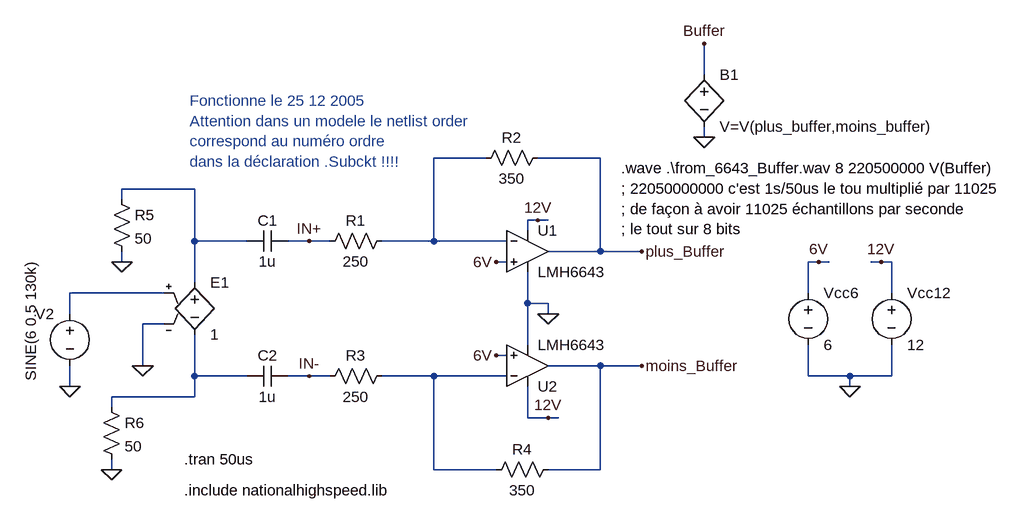
[diagram p0: schematic ADSL_buffer_LMH6643.asc]
ADSL_buffer_LMH6643.asc, the LTspice schematic file:
Version 4
SHEET 1 1004 680
WIRE -496 224 -496 192
WIRE -496 336 -496 304
WIRE -432 368 -432 352
WIRE -432 464 -432 448
WIRE -416 48 -416 32
WIRE -416 144 -416 128
WIRE -384 304 -384 240
WIRE -352 192 -496 192
WIRE -352 240 -384 240
WIRE -304 32 -416 32
WIRE -304 112 -304 32
WIRE -304 176 -304 112
WIRE -304 320 -304 256
WIRE -304 352 -432 352
WIRE -304 352 -304 320
WIRE -224 112 -304 112
WIRE -224 320 -304 320
WIRE -128 112 -160 112
WIRE -128 320 -160 320
WIRE -96 112 -128 112
WIRE -96 320 -128 320
WIRE 64 112 -16 112
WIRE 64 112 64 -16
WIRE 64 320 -16 320
WIRE 64 464 64 320
WIRE 144 -16 64 -16
WIRE 160 464 64 464
WIRE 176 112 64 112
WIRE 176 144 160 144
WIRE 176 288 160 288
WIRE 176 320 64 320
WIRE 208 96 208 80
WIRE 208 208 208 160
WIRE 208 272 208 208
WIRE 208 384 208 336
WIRE 224 80 208 80
WIRE 240 80 224 80
WIRE 240 208 208 208
WIRE 240 224 240 208
WIRE 240 384 208 384
WIRE 256 384 240 384
WIRE 320 -16 224 -16
WIRE 320 128 240 128
WIRE 320 128 320 -16
WIRE 320 304 240 304
WIRE 320 464 240 464
WIRE 320 464 320 304
WIRE 384 128 320 128
WIRE 384 304 320 304
WIRE 480 -144 480 -192
WIRE 480 -48 480 -64
WIRE 640 192 640 144
WIRE 640 320 640 272
WIRE 656 144 640 144
WIRE 672 144 656 144
WIRE 704 320 640 320
WIRE 704 336 704 320
WIRE 752 144 736 144
WIRE 768 144 752 144
WIRE 768 192 768 144
WIRE 768 320 704 320
WIRE 768 320 768 272
FLAG 704 336 0
FLAG 752 144 12V
FLAG 656 144 6V
FLAG 240 224 0
FLAG 160 144 6V
FLAG 160 288 6V
FLAG 384 128 plus_Buffer
FLAG 384 304 moins_Buffer
FLAG 224 80 12V
FLAG 240 384 12V
FLAG -128 112 IN+
FLAG -128 320 IN-
FLAG -384 304 0
FLAG -496 336 0
FLAG -432 464 0
FLAG -416 144 0
FLAG 480 -48 0
FLAG 480 -192 Buffer
SYMBOL voltage 768 176 R0
WINDOW 123 0 0 Left 0
WINDOW 39 0 0 Left 0
SYMATTR InstName Vcc12
SYMATTR Value 12
SYMBOL voltage 640 176 R0
WINDOW 123 0 0 Left 0
WINDOW 39 0 0 Left 0
SYMATTR InstName Vcc6
SYMATTR Value 6
SYMBOL res 240 -32 R90
WINDOW 0 0 56 VBottom 0
WINDOW 3 32 56 VTop 0
SYMATTR InstName R2
SYMATTR Value 350
SYMBOL res 0 96 R90
WINDOW 0 0 56 VBottom 0
WINDOW 3 32 56 VTop 0
SYMATTR InstName R1
SYMATTR Value 250
SYMBOL res 0 304 R90
WINDOW 0 0 56 VBottom 0
WINDOW 3 32 56 VTop 0
SYMATTR InstName R3
SYMATTR Value 250
SYMBOL res 256 448 R90
WINDOW 0 0 56 VBottom 0
WINDOW 3 32 56 VTop 0
SYMATTR InstName R4
SYMATTR Value 350
SYMBOL voltage -496 208 M0
WINDOW 123 24 132 Left 0
WINDOW 39 0 0 Left 0
WINDOW 3 60 -65 VRight 0
SYMATTR Value SINE(6 0.5 130k)
SYMATTR InstName V2
SYMBOL cap -160 96 R90
WINDOW 0 0 32 VBottom 0
WINDOW 3 32 32 VTop 0
SYMATTR InstName C1
SYMATTR Value 1u
SYMBOL cap -160 304 R90
WINDOW 0 0 32 VBottom 0
WINDOW 3 32 32 VTop 0
SYMATTR InstName C2
SYMATTR Value 1u
SYMBOL e -304 160 R0
SYMATTR InstName E1
SYMATTR Value 1
SYMBOL res -432 32 R0
SYMATTR InstName R5
SYMATTR Value 50
SYMBOL res -448 352 R0
SYMATTR InstName R6
SYMATTR Value 50
SYMBOL LMH6643 208 128 R0
SYMATTR InstName U1
SYMBOL LMH6643 208 304 M180
SYMATTR InstName U2
SYMBOL bv 480 -160 R0
SYMATTR InstName B1
SYMATTR Value V=V(plus_buffer,moins_buffer)
TEXT -320 448 Left 0 !.tran 50us
TEXT -320 496 Left 0 !.include nationalhighspeed.lib
TEXT -312 -104 Left 0 ;Fonctionne le 25 12 2005\nAttention dans un modele le netlist order \ncorrespond au numéro ordre \ndans la déclaration .Subckt !!!!
TEXT 352 0 Left 0 !.wave .\\from_6643_Buffer.wav 8 220500000 V(Buffer) \n; 22050000000 c'est 1s/50us le tou multiplié par 11025\n; de façon à avoir 11025 échantillons par seconde\n; le tout sur 8 bits

The netlist it stands for:
* ADSL_buffer_LMH6643.asc
Vcc12 12V 0 12
Vcc6 6V 0 6
R2 plus_Buffer N004 350
R1 N004 IN+ 250
R3 N005 IN- 250
R4 moins_Buffer N005 350
V2 N001 0 SINE(6 0.5 130k)
C1 IN+ N003 1u
C2 IN- N002 1u
E1 N003 N002 N001 0 1
R5 N003 0 50
R6 N002 0 50
* U1: LMH6643 (symbol LMH6643 not available, pins judged from their places): In+=6V In-=N004 V+=12V V-=0 OUT=plus_Buffer
* U2: LMH6643 (symbol LMH6643 not available, pins judged from their places): In+=6V In-=N005 V+=12V V-=0 OUT=moins_Buffer
B1 Buffer 0 V=V(plus_buffer,moins_buffer)
.tran 50us
.include nationalhighspeed.lib
* Fonctionne le 25 12 2005
* Attention dans un modele le netlist order
* correspond au numéro ordre
* dans la déclaration .Subckt !!!!
.wave .\from_6643_Buffer.wav 8 220500000 V(Buffer)
; 22050000000 c'est 1s/50us le tou multiplié par 11025
; de façon à avoir 11025 échantillons par seconde
; le tout sur 8 bits
.backanno
.end